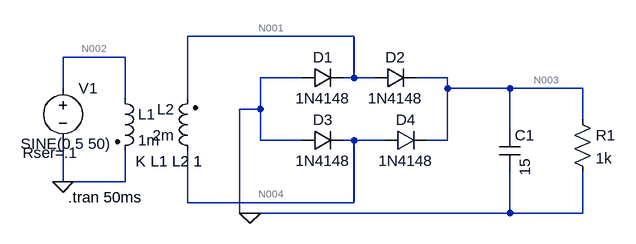
[diagram p0: schematic Full Wave.asc]
Full Wave.asc, the LTspice schematic file:
Version 4
SHEET 1 880 680
WIRE 352 48 96 48
WIRE 0 80 -96 80
WIRE 272 112 208 112
WIRE 352 112 352 48
WIRE 352 112 336 112
WIRE 384 112 352 112
WIRE 496 112 448 112
WIRE -96 128 -96 80
WIRE 496 128 496 112
WIRE 592 128 496 128
WIRE 704 128 592 128
WIRE 0 144 0 80
WIRE 96 144 96 48
WIRE 208 160 208 112
WIRE 208 160 176 160
WIRE 704 176 704 128
WIRE 592 192 592 128
WIRE 208 208 208 160
WIRE 272 208 208 208
WIRE 352 208 336 208
WIRE 400 208 352 208
WIRE 496 208 496 128
WIRE 496 208 464 208
WIRE -96 272 -96 208
WIRE 0 272 0 224
WIRE 0 272 -96 272
WIRE 96 304 96 224
WIRE 352 304 352 208
WIRE 352 304 96 304
WIRE 176 320 176 160
WIRE 192 320 176 320
WIRE 592 320 592 256
WIRE 592 320 192 320
WIRE 704 320 704 256
WIRE 704 320 592 320
FLAG 192 320 0
FLAG -96 272 0
SYMBOL voltage -96 112 R0
WINDOW 3 -65 101 Left 2
WINDOW 123 0 0 Left 0
WINDOW 39 -62 115 Left 2
SYMATTR Value SINE(0 5 50)
SYMATTR SpiceLine Rser=.1
SYMATTR InstName V1
SYMBOL ind2 -16 128 R0
SYMATTR InstName L1
SYMATTR Value 1m
SYMATTR SpiceLine Ipk=.1
SYMATTR Type ind
SYMBOL ind2 112 240 R180
WINDOW 0 36 80 Left 2
WINDOW 3 36 40 Left 2
SYMATTR InstName L2
SYMATTR Value 2m
SYMATTR Type ind
SYMBOL diode 272 128 R270
WINDOW 0 32 32 VTop 2
WINDOW 3 0 32 VBottom 2
SYMATTR InstName D1
SYMATTR Value 1N4148
SYMBOL diode 384 128 R270
WINDOW 0 32 32 VTop 2
WINDOW 3 0 32 VBottom 2
SYMATTR InstName D2
SYMATTR Value 1N4148
SYMBOL diode 272 224 R270
WINDOW 0 32 32 VTop 2
WINDOW 3 0 32 VBottom 2
SYMATTR InstName D3
SYMATTR Value 1N4148
SYMBOL diode 400 224 R270
WINDOW 0 32 32 VTop 2
WINDOW 3 0 32 VBottom 2
SYMATTR InstName D4
SYMATTR Value 1N4148
SYMBOL res 688 160 R0
SYMATTR InstName R1
SYMATTR Value 1k
SYMBOL cap 576 192 R0
WINDOW 3 39 71 VLeft 2
SYMATTR Value 15
SYMATTR InstName C1
SYMATTR SpiceLine V=2.7 Irms=0 Rser=0.03 Lser=25n mfg="Würth Elektronik" pn="850617021005 WCAP-STSC 13x25" type="Super Capacitor"
TEXT -88 296 Left 2 !.tran 50ms
TEXT 16 240 Left 2 !K L1 L2 1

The netlist it stands for:
* Full Wave.asc
V1 N002 0 SINE(0 5 50) Rser=.1
L1 N002 0 1m Ipk=.1
L2 N004 N001 2m
D1 0 N001 1N4148
D2 N001 N003 1N4148
D3 0 N004 1N4148
D4 N004 N003 1N4148
R1 N003 0 1k
C1 N003 0 15 V=2.7 Irms=0 Rser=0.03 Lser=25n mfg="Würth Elektronik" pn="850617021005 WCAP-STSC 13x25" type="Super Capacitor"
.model D D
.lib standard.dio
.tran 50ms
K L1 L2 1
.backanno
.end

* Results of the author's LTspice run, read from the files saved beside the schematic
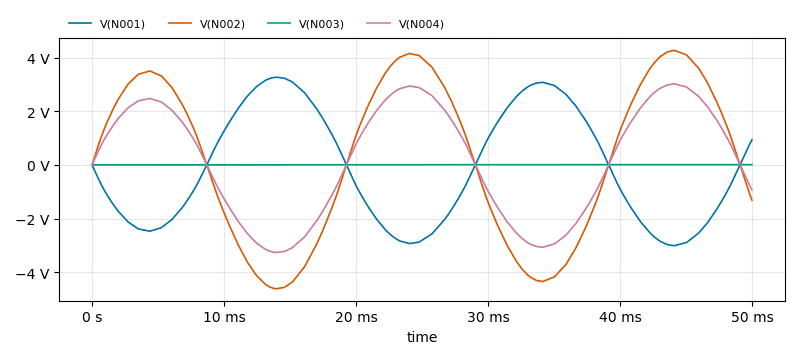
[diagram p1: Transient Analysis of Full Wave.asc, plotted from the saved traces]
* Transient Analysis, 1 run:
*   V(N001): min -3.012 V, max 3.267 V, average -186.6 mV, rms 2.108 V, last 938.2 mV
*   V(N002): min -4.618 V, max 4.266 V, average 267.1 mV, rms 2.982 V, last -1.32 V
*   V(N003): min 0 V, max 9.364 mV, average 4.621 mV, rms 5.44 mV, last 9.364 mV
*   V(N004): min -3.264 V, max 3.021 V, average 191.2 mV, rms 2.109 V, last -928.8 mV